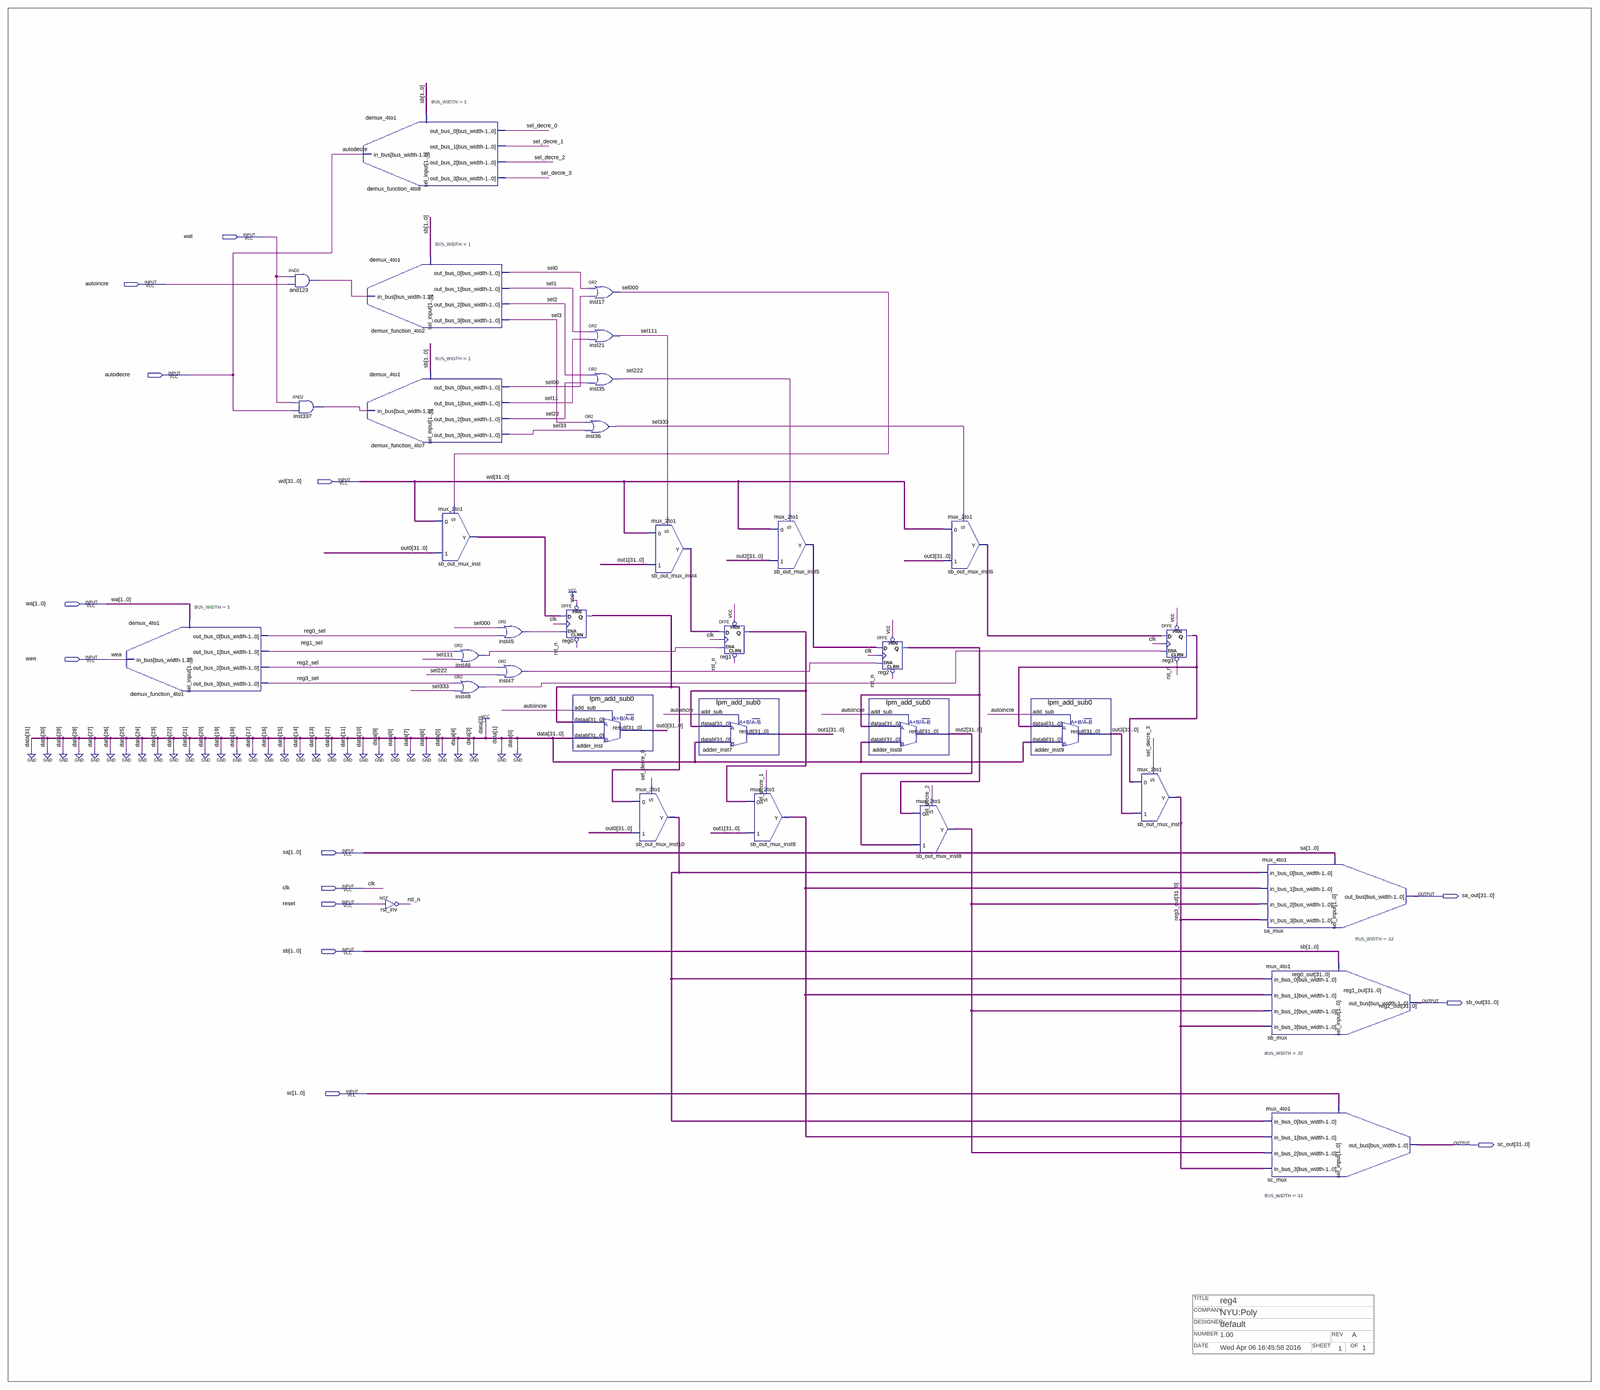
[diagram p0: schematic sheet, whole]
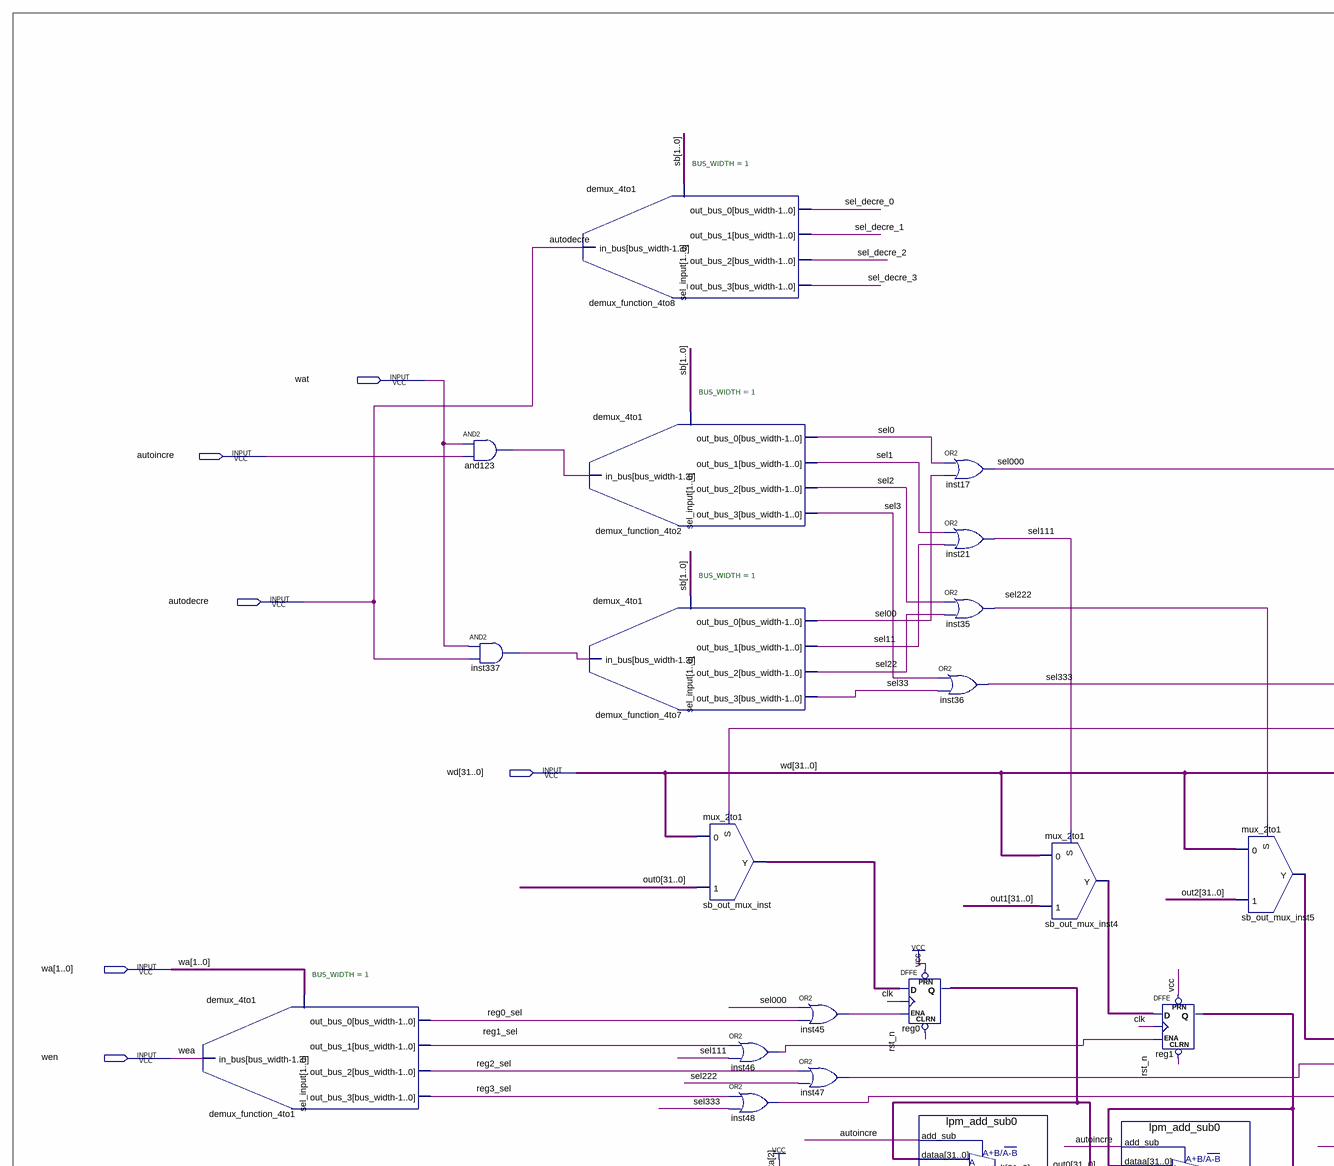
[diagram p1: schematic sheet, upper left part]
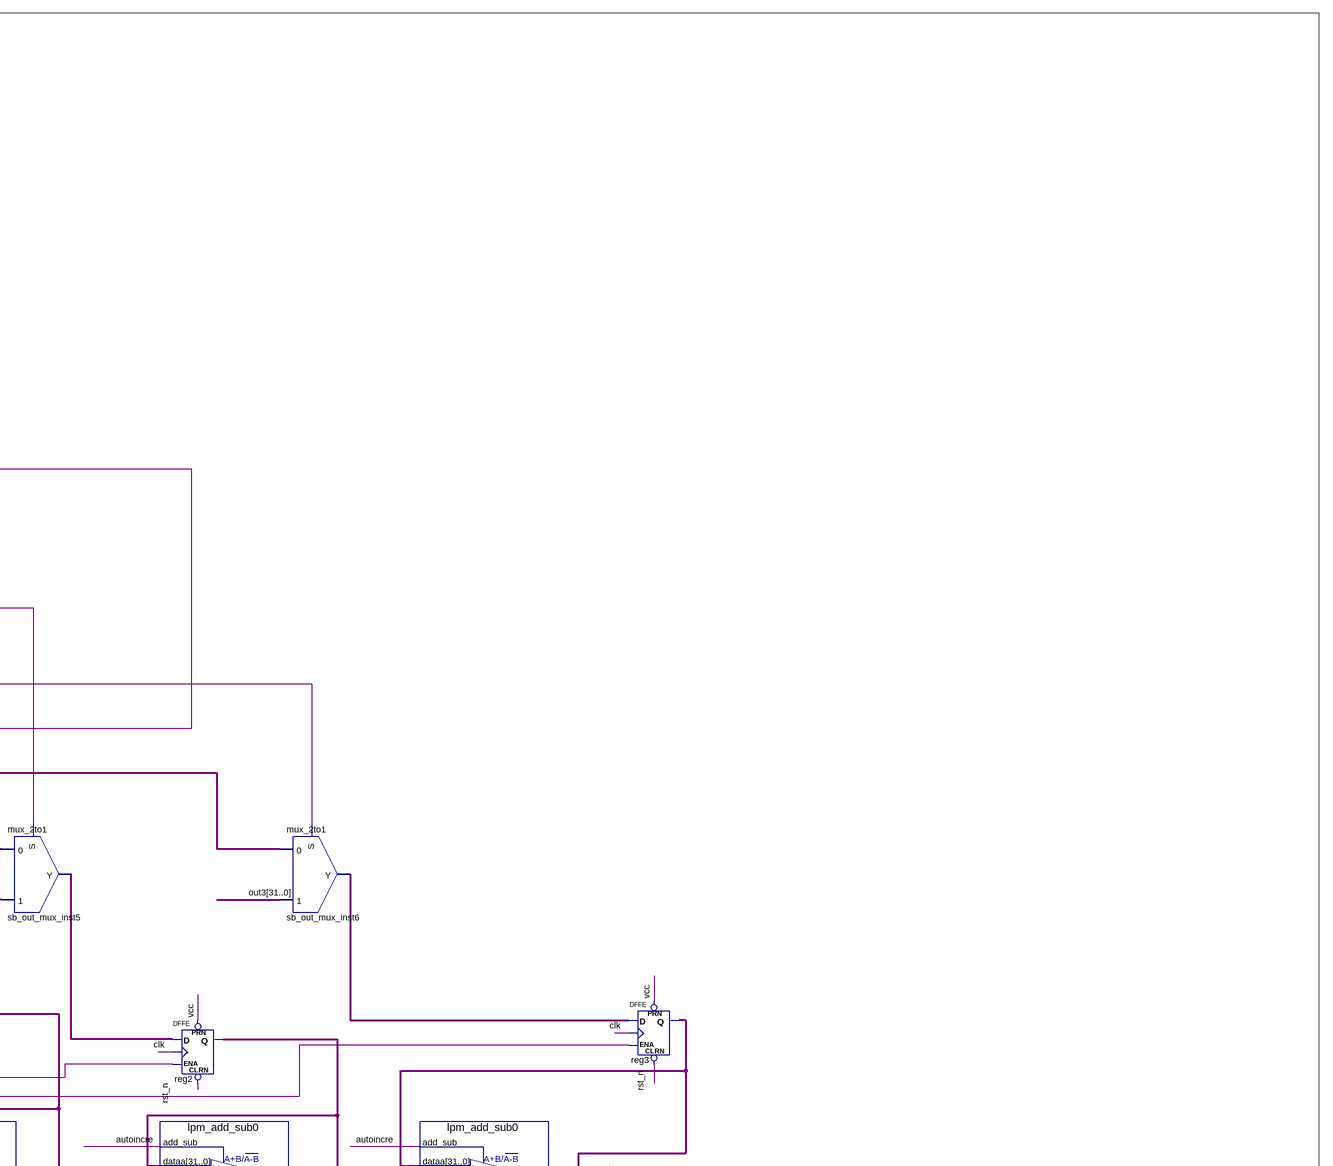
[diagram p2: schematic sheet, upper right part]
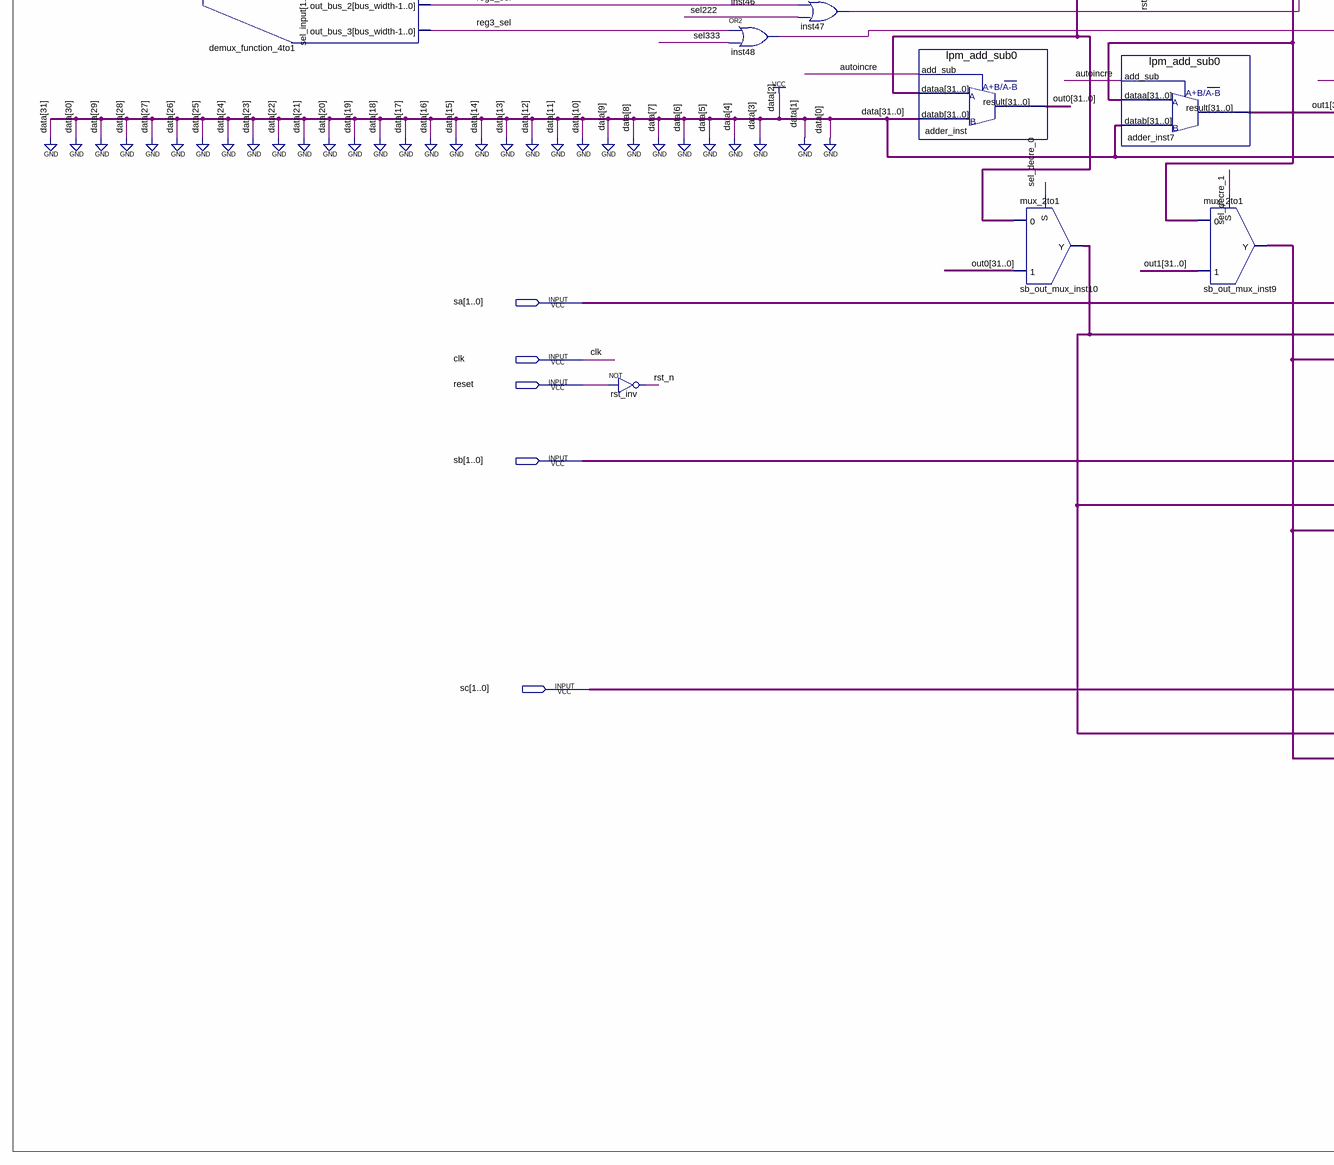
[diagram p3: schematic sheet, lower left part]
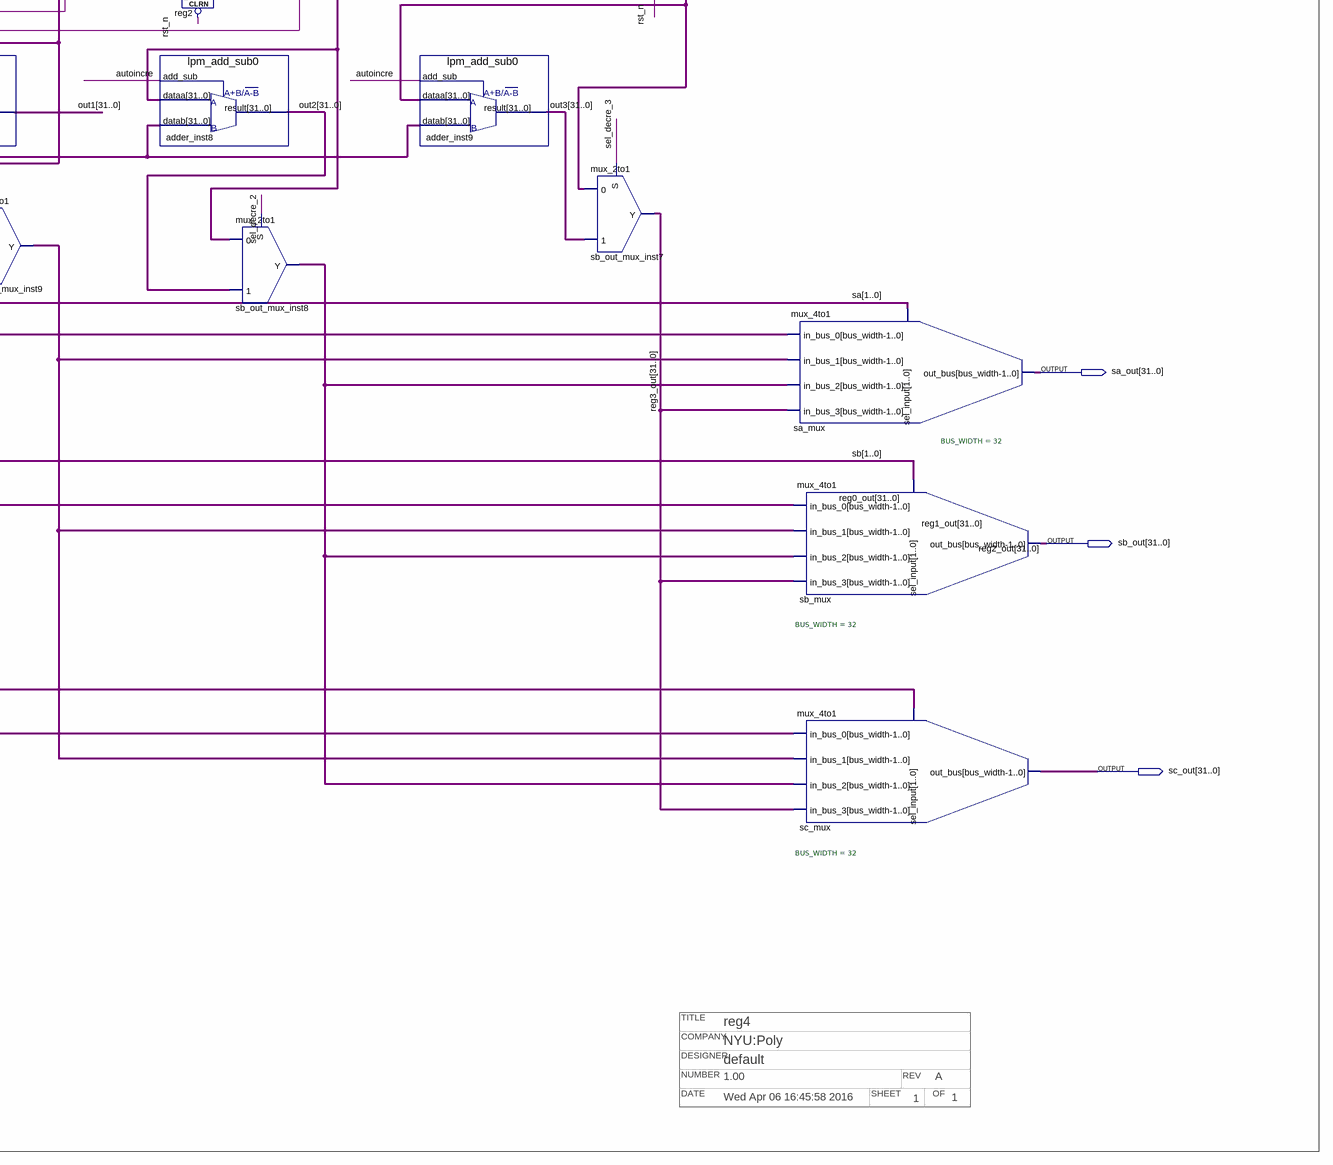
[diagram p4: schematic sheet, lower right part]
// Quartus schematic reg4.bdf as structural Verilog: 34 symbols, 14 pins
// Title block: COMPANY: NYU:Poly; DATE: Wed Apr 06 16:45:58 2016; DESIGNER: default; NUMBER: 1.00; OF: 1; REV: A; SHEET: 1; TITLE: reg4
module reg4 (
  input  wat,
  input  autoincre,
  input  autodecre,
  input  [31:0] wd,
  input  [1:0] wa,
  input  wen,
  input  [1:0] sa,
  input  clk,
  input  reset,
  input  [1:0] sb,
  input  [1:0] sc,
  output [31:0] sa_out,
  output [31:0] sb_out,
  output [31:0] sc_out
);

  wire and123_out, inst45_out, inst46_out, inst47_out, inst48_out, inst337_out, reg0_sel, reg1_sel, reg2_sel,
       reg3_sel, rst_n, sel000, sel0, sel00, sel1, sel2, sel3, sel11, sel22, sel33, sel111, sel222, sel333,
       sel_decre_0, sel_decre_1, sel_decre_2, sel_decre_3;
  wire [31:0] out0, out1, out2, out3, reg0_out, reg0_q, reg1_out, reg1_q, reg2_out, reg2_q, reg3_out, reg3_q,
       sb_out_mux_inst4_out_bus, sb_out_mux_inst5_out_bus, sb_out_mux_inst6_out_bus, sb_out_mux_inst_out_bus;

  demux_4to1 #(.BUS_WIDTH(1)) demux_function_4to1 (
    .sel_input(wa), .in_bus(wen), .out_bus_0(reg0_sel), .out_bus_1(reg1_sel), .out_bus_2(reg2_sel),
    .out_bus_3(reg3_sel));
  and and123 (and123_out, wat, autoincre);
  and inst337 (inst337_out, wat, autodecre);
  demux_4to1 #(.BUS_WIDTH(1)) demux_function_4to8 (
    .sel_input(sb), .in_bus(autodecre), .out_bus_0(sel_decre_0), .out_bus_1(sel_decre_1),
    .out_bus_2(sel_decre_2), .out_bus_3(sel_decre_3));
  demux_4to1 #(.BUS_WIDTH(1)) demux_function_4to2 (
    .sel_input(sb), .in_bus(and123_out), .out_bus_0(sel0), .out_bus_1(sel1), .out_bus_2(sel2),
    .out_bus_3(sel3));
  demux_4to1 #(.BUS_WIDTH(1)) demux_function_4to7 (
    .sel_input(sb), .in_bus(inst337_out), .out_bus_0(sel00), .out_bus_1(sel11), .out_bus_2(sel22),
    .out_bus_3(sel33));
  not rst_inv (rst_n, reset);
  mux_2to1 sb_out_mux_inst (.in_bus_1(out0), .in_bus_0(wd), .sel_input(sel000), .out_bus(sb_out_mux_inst_out_bus));
  or inst46 (inst46_out, reg1_sel, sel111);
  or inst48 (inst48_out, reg3_sel, sel333);
  or inst45 (inst45_out, sel000, reg0_sel);
  or inst47 (inst47_out, reg2_sel, sel222);
  or inst36 (sel333, sel3, sel33);
  DFFE reg0[31:0] (.PRN(1'b1), .CLRN(rst_n), .D(sb_out_mux_inst_out_bus), .CLK(clk), .ENA(inst45_out), .Q(reg0_q));
  lpm_add_sub0 adder_inst (
    .add_sub(autoincre), .dataa(reg0_q), .datab(32'b00000000000000000000000000000100), .result(out0));
  or inst17 (sel000, sel0, sel00);
  or inst21 (sel111, sel1, sel11);
  or inst35 (sel222, sel2, sel22);
  mux_2to1 sb_out_mux_inst4 (.in_bus_1(out1), .in_bus_0(wd), .sel_input(sel111), .out_bus(sb_out_mux_inst4_out_bus));
  mux_2to1 sb_out_mux_inst10 (.in_bus_1(out0), .in_bus_0(reg0_q), .sel_input(sel_decre_0), .out_bus(reg0_out));
  lpm_add_sub0 adder_inst7 (
    .add_sub(autoincre), .dataa(reg1_q), .datab(32'b00000000000000000000000000000100), .result(out1));
  DFFE reg1[31:0] (.PRN(1'b1), .CLRN(rst_n), .D(sb_out_mux_inst4_out_bus), .CLK(clk), .ENA(inst46_out), .Q(reg1_q));
  mux_2to1 sb_out_mux_inst5 (.in_bus_1(out2), .in_bus_0(wd), .sel_input(sel222), .out_bus(sb_out_mux_inst5_out_bus));
  mux_2to1 sb_out_mux_inst9 (.in_bus_1(out1), .in_bus_0(reg1_q), .sel_input(sel_decre_1), .out_bus(reg1_out));
  lpm_add_sub0 adder_inst8 (
    .add_sub(autoincre), .dataa(reg2_q), .datab(32'b00000000000000000000000000000100), .result(out2));
  DFFE reg2[31:0] (.PRN(1'b1), .CLRN(rst_n), .D(sb_out_mux_inst5_out_bus), .CLK(clk), .ENA(inst47_out), .Q(reg2_q));
  mux_2to1 sb_out_mux_inst8 (.in_bus_1(out2), .in_bus_0(reg2_q), .sel_input(sel_decre_2), .out_bus(reg2_out));
  mux_2to1 sb_out_mux_inst6 (.in_bus_1(out3), .in_bus_0(wd), .sel_input(sel333), .out_bus(sb_out_mux_inst6_out_bus));
  lpm_add_sub0 adder_inst9 (
    .add_sub(autoincre), .dataa(reg3_q), .datab(32'b00000000000000000000000000000100), .result(out3));
  mux_2to1 sb_out_mux_inst7 (.in_bus_1(out3), .in_bus_0(reg3_q), .sel_input(sel_decre_3), .out_bus(reg3_out));
  DFFE reg3[31:0] (.PRN(1'b1), .CLRN(rst_n), .D(sb_out_mux_inst6_out_bus), .CLK(clk), .ENA(inst48_out), .Q(reg3_q));
  mux_4to1 #(.BUS_WIDTH(32)) sa_mux (
    .sel_input(sa), .in_bus_0(reg0_out), .in_bus_1(reg1_out), .in_bus_2(reg2_out), .in_bus_3(reg3_out),
    .out_bus(sa_out));
  mux_4to1 #(.BUS_WIDTH(32)) sb_mux (
    .sel_input(sb), .in_bus_0(reg0_out), .in_bus_1(reg1_out), .in_bus_2(reg2_out), .in_bus_3(reg3_out),
    .out_bus(sb_out));
  mux_4to1 #(.BUS_WIDTH(32)) sc_mux (
    .sel_input(sc), .in_bus_0(reg0_out), .in_bus_1(reg1_out), .in_bus_2(reg2_out), .in_bus_3(reg3_out),
    .out_bus(sc_out));

  // Other names for the same wires on the sheet: wea = wen
endmodule
